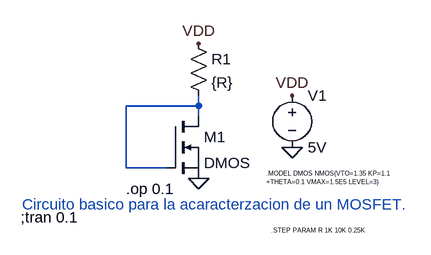
[diagram p0: schematic Caracterizacion del BSS138.asc]
Caracterizacion del BSS138.asc, the LTspice schematic file:
Version 4
SHEET 1 880 680
WIRE 192 160 192 144
WIRE 192 160 80 160
WIRE 192 176 192 160
WIRE 80 256 80 160
WIRE 144 256 80 256
FLAG 192 272 0
FLAG 192 64 VDD
FLAG 336 224 0
FLAG 336 144 VDD
SYMBOL res 176 48 R0
SYMATTR InstName R1
SYMATTR Value {R}
SYMBOL nmos 144 176 R0
SYMATTR InstName M1
SYMATTR Value DMOS
SYMBOL voltage 336 128 R0
WINDOW 123 0 0 Left 0
WINDOW 39 0 0 Left 0
SYMATTR InstName V1
SYMATTR Value 5V
TEXT -80 312 Left 2 ;Circuito basico para la acaracterzacion de un MOSFET.
TEXT 296 264 Left 0 !.MODEL DMOS NMOS(VTO=1.35 KP=1.1\n+THETA=0.1 VMAX=1.5E5 LEVEL=3)
TEXT -82 332 Left 2 !;tran 0.1
TEXT 304 352 Left 0 !.STEP PARAM R 1K 10K 0.25K
TEXT 80 288 Left 2 !.op 0.1

The netlist it stands for:
* Caracterizacion del BSS138.asc
R1 VDD N001 {R}
M1 N001 N001 0 0 DMOS
V1 VDD 0 5V
.model NMOS NMOS
.model PMOS PMOS
.lib standard.mos
* Circuito basico para la acaracterzacion de un MOSFET.
.MODEL DMOS NMOS(VTO=1.35 KP=1.1
+THETA=0.1 VMAX=1.5E5 LEVEL=3)
;tran 0.1
.STEP PARAM R 1K 10K 0.25K
.op 0.1
.backanno
.end